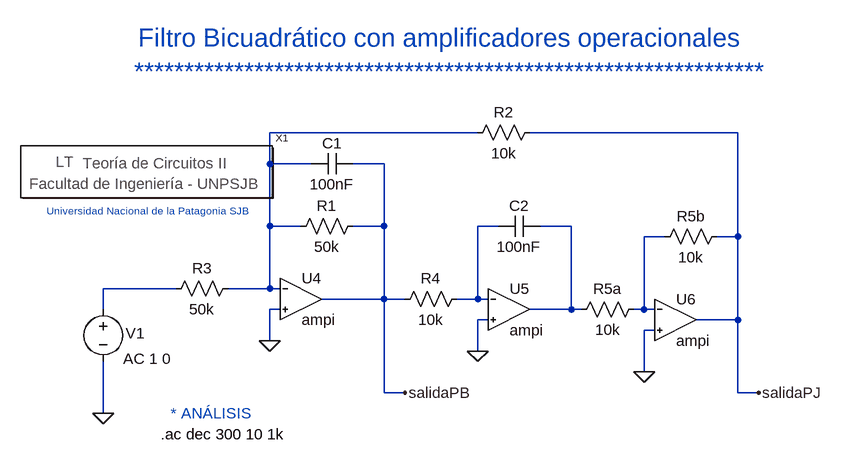
[diagram p0: schematic Filtro Bicuadrático.asc]
Filtro Bicuadrático.asc, the LTspice schematic file:
Version 4
SHEET 1 2596 1536
WIRE 400 -32 80 -32
WIRE 800 -32 480 -32
WIRE 80 16 80 -32
WIRE 144 16 80 16
WIRE 256 16 208 16
WIRE 80 112 80 16
WIRE 128 112 80 112
WIRE 256 112 256 16
WIRE 256 112 208 112
WIRE 432 112 400 112
WIRE 544 112 496 112
WIRE 688 128 656 128
WIRE 800 128 800 -32
WIRE 800 128 768 128
WIRE -64 208 -176 208
WIRE 80 208 80 112
WIRE 80 208 16 208
WIRE 96 208 80 208
WIRE 256 224 256 112
WIRE 256 224 160 224
WIRE 288 224 256 224
WIRE 400 224 400 112
WIRE 400 224 368 224
WIRE 416 224 400 224
WIRE -176 240 -176 208
WIRE 96 240 80 240
WIRE 544 240 544 112
WIRE 544 240 480 240
WIRE 560 240 544 240
WIRE 656 240 656 128
WIRE 656 240 640 240
WIRE 672 240 656 240
WIRE 416 256 400 256
WIRE 800 256 800 128
WIRE 800 256 736 256
WIRE 672 272 656 272
WIRE 80 288 80 240
WIRE 400 304 400 256
WIRE 656 336 656 272
WIRE 256 368 256 224
WIRE 288 368 256 368
WIRE 800 368 800 256
WIRE 832 368 800 368
WIRE -176 400 -176 320
FLAG -176 400 0
FLAG 80 288 0
FLAG 400 304 0
FLAG 656 336 0
FLAG 832 368 salidaPJ
FLAG 288 368 salidaPB
SYMBOL voltage -176 224 M0
WINDOW 0 -64 53 Left 2
WINDOW 123 -104 92 Left 2
WINDOW 39 0 0 Left 2
SYMATTR InstName V1
SYMATTR Value2 AC 1 0
SYMATTR Value ""
SYMBOL res 32 192 R90
WINDOW 0 0 56 VBottom 2
WINDOW 3 32 56 VTop 2
SYMATTR InstName R3
SYMATTR Value 50k
SYMBOL res 224 96 R90
WINDOW 0 0 56 VBottom 2
WINDOW 3 32 56 VTop 2
SYMATTR InstName R1
SYMATTR Value 50k
SYMBOL res 496 -48 R90
WINDOW 0 0 56 VBottom 2
WINDOW 3 32 56 VTop 2
SYMATTR InstName R2
SYMATTR Value 10k
SYMBOL res 384 208 R90
WINDOW 0 0 56 VBottom 2
WINDOW 3 32 56 VTop 2
SYMATTR InstName R4
SYMATTR Value 10k
SYMBOL res 656 224 R90
WINDOW 0 0 56 VBottom 2
WINDOW 3 32 56 VTop 2
SYMATTR InstName R5a
SYMATTR Value 10k
SYMBOL res 784 112 R90
WINDOW 0 0 56 VBottom 2
WINDOW 3 32 56 VTop 2
SYMATTR InstName R5b
SYMATTR Value 10k
SYMBOL cap 208 0 R90
WINDOW 0 0 32 VBottom 2
WINDOW 3 32 32 VTop 2
SYMATTR InstName C1
SYMATTR Value 100nF
SYMBOL cap 496 96 R90
WINDOW 0 0 32 VBottom 2
WINDOW 3 32 32 VTop 2
SYMATTR InstName C2
SYMATTR Value 100nF
SYMBOL ampi 128 160 R0
SYMATTR InstName U4
SYMBOL ampi 448 176 R0
SYMATTR InstName U5
SYMBOL ampi 704 192 R0
SYMATTR InstName U6
SYMBOL Circuitos2\\Letreros\\Teoría\ de\ Circuitos\ II -112 32 R0
SYMATTR InstName X1
TEXT -88 432 Left 2 !.ac dec 300 10 1k
TEXT -112 88 Center 1 ;Universidad Nacional de la Patagonia SJB
TEXT 344 -152 Center 4 ;Filtro Bicuadrático con amplificadores operacionales\n***************************************************************
TEXT -72 400 Left 2 ;* ANÁLISIS

The netlist it stands for:
* Filtro Bicuadrático.asc
V1 N005 0 AC 1 0
R3 N001 N005 50k
R1 salidaPB N001 50k
R2 salidaPJ N001 10k
R4 N002 salidaPB 10k
R5a N004 N003 10k
R5b salidaPJ N004 10k
C1 salidaPB N001 100nF
C2 N003 N002 100nF
XU4 0 N001 salidaPB ampi Ren=1e9, Rsal=1, A=1e9  ; pins p n s
XU5 0 N002 N003 ampi Ren=1e9, Rsal=1, A=1e9  ; pins p n s
XU6 0 N004 salidaPJ ampi Ren=1e9, Rsal=1, A=1e9  ; pins p n s
XX1 Teoría de Circuitos II
.ac dec 300 10 1k
* Universidad Nacional de la Patagonia SJB
* Filtro Bicuadrático con amplificadores operacionales
* ***************************************************************
* * ANÁLISIS
.lib ..\sym\Circuitos2\ComponentesIdeales\compoideales.lib
.backanno
.end